# EAGLE design AJH_2b_v1_03 (EAGLE 9.6.2)

## Sheet 1 of 3
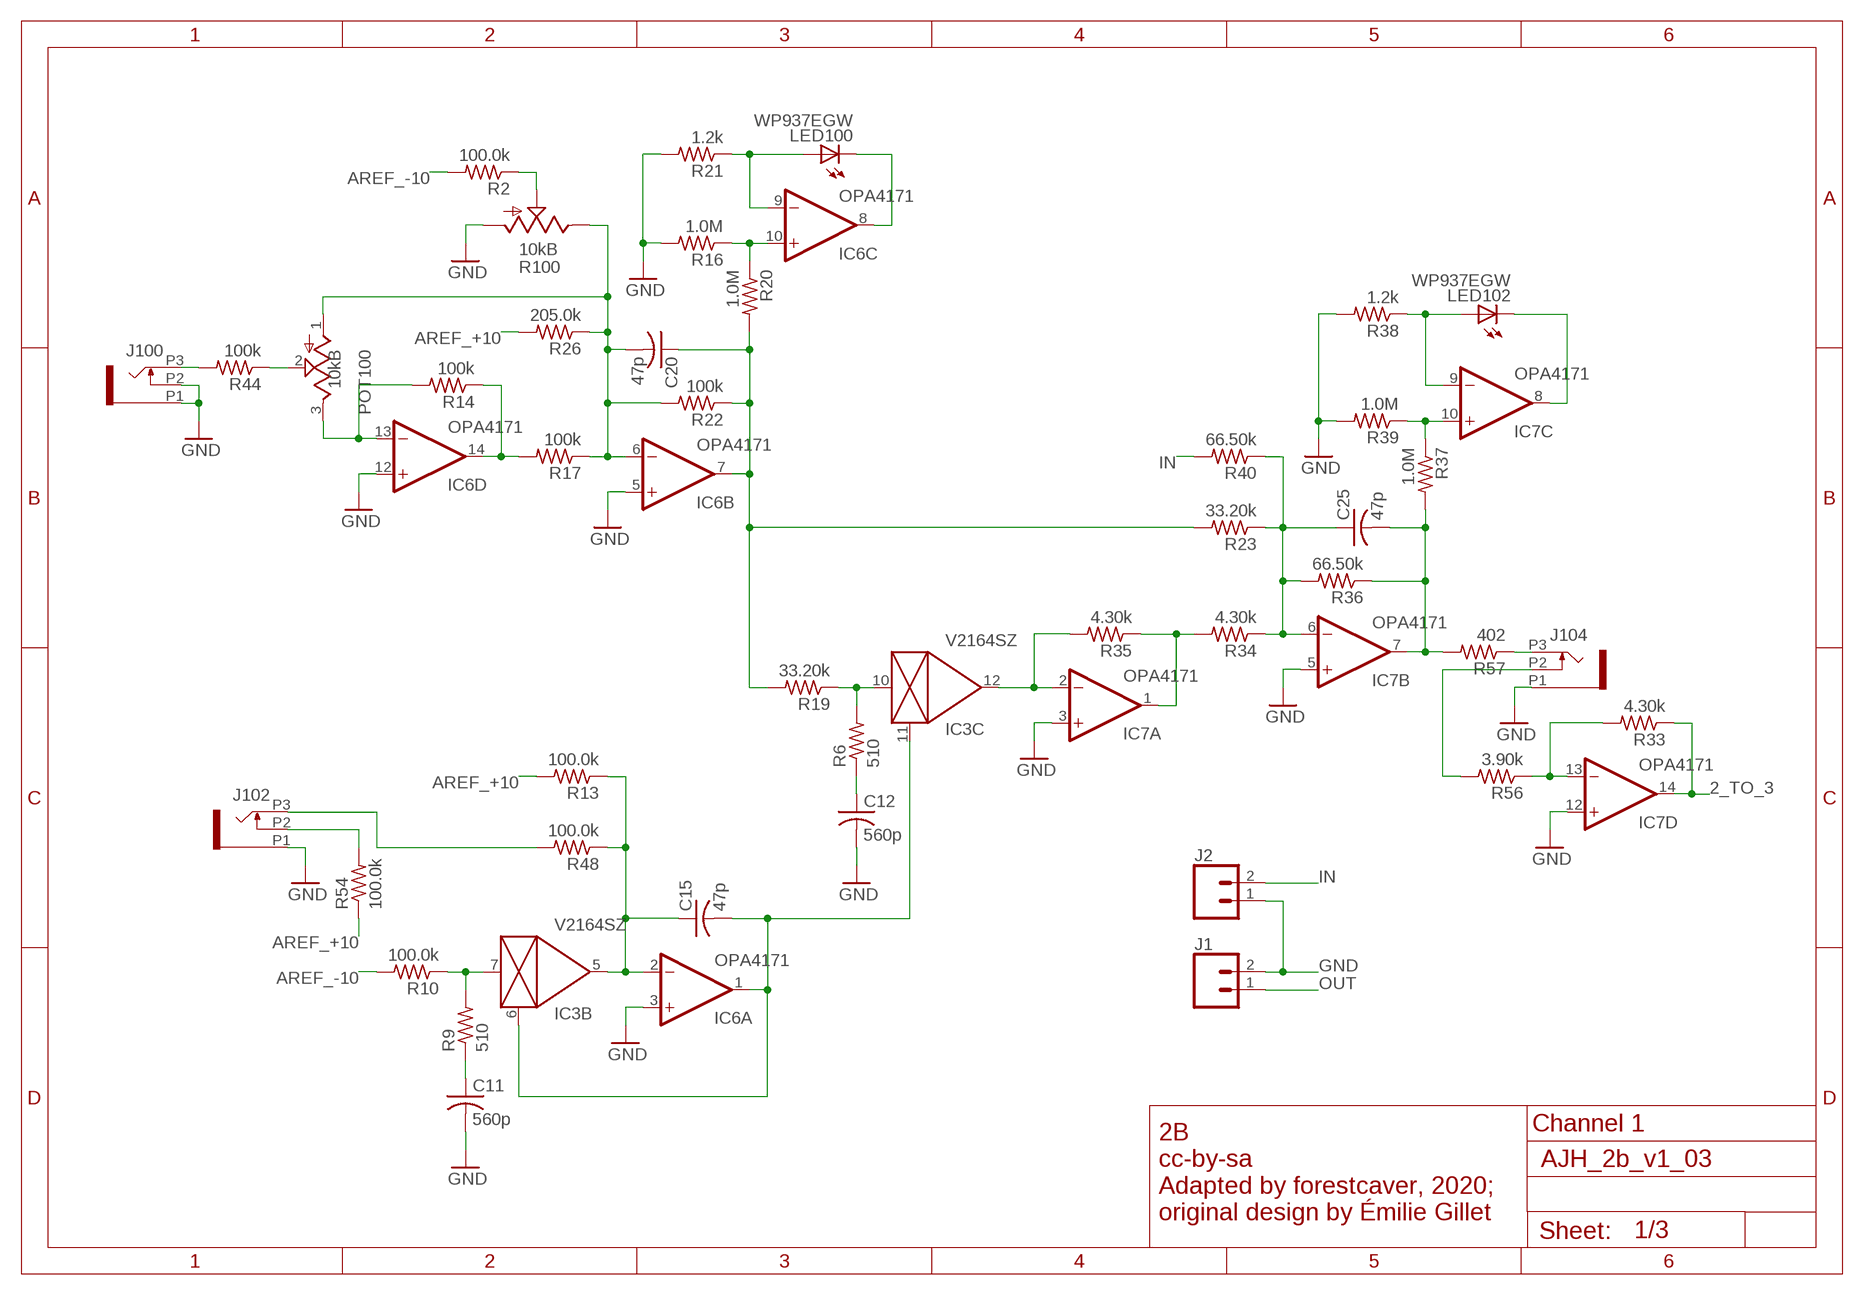
[diagram p0: schematic, sheet 1]

### Parts
C11  560p  C-USC0402  [C0402]
C12  560p  C-USC0402  [C0402]
C15  47p  C-USC0402  [C0402]
C20  47p  C-USC0402  [C0402]
C25  47p  C-USC0402  [C0402]
IC3  V2164SZ  SSM2164S  [SOIC16N]
IC6  OPA4171  TL074PW  [TSSOP14]
IC7  OPA4171  TL074PW  [TSSOP14]
J1  CONN_02  [1X02]
J2  CONN_02  [1X02]
J100  PJ301_THONKICONN6  [WQP_PJ_301M6]
J102  PJ301_THONKICONN6  [WQP_PJ_301M6]
J104  PJ301_THONKICONN6  [WQP_PJ_301M6]
LED100  WP937EGW  LED3MM  [LED3MM]
LED102  WP937EGW  LED3MM  [LED3MM]
POT100  10kB  POT_VERTICALNOHOLE  [ALPS_POT_NOHOLE]
R2  100.0k  R-US_R0402  [R0402]
R6  510  R-US_R0402  [R0402]
R9  510  R-US_R0402  [R0402]
R10  100.0k  R-US_R0402  [R0402]
R13  100.0k  R-US_R0402  [R0402]
R14  100k  R-US_R0402  [R0402]
R16  1.0M  R-US_R0402  [R0402]
R17  100k  R-US_R0402  [R0402]
R19  33.20k  R-US_R0402  [R0402]
R20  1.0M  R-US_R0402  [R0402]
R21  1.2k  R-US_R0402  [R0402]
R22  100k  R-US_R0402  [R0402]
R23  33.20k  R-US_R0402  [R0402]
R26  205.0k  R-US_R0402  [R0402]
R33  4.30k  R-US_R0402  [R0402]
R34  4.30k  R-US_R0402  [R0402]
R35  4.30k  R-US_R0402  [R0402]
R36  66.50k  R-US_R0402  [R0402]
R37  1.0M  R-US_R0402  [R0402]
R38  1.2k  R-US_R0402  [R0402]
R39  1.0M  R-US_R0402  [R0402]
R40  66.50k  R-US_R0402  [R0402]
R44  100k  R-US_R0402  [R0402]
R48  100.0k  R-US_R0402  [R0402]
R54  100.0k  R-US_R0402  [R0402]
R56  3.90k  R-US_R0402  [R0402]
R57  402  R-US_R0402  [R0402]
R100  10kB  POT_USVERTICAL_PS  [ALPS_POT_VERTICAL_PS]

### Nets
2_TO_3: IC7.14(D:OUT) R33.1 ; also sheet 2
AREF_+10: R13.2 R26.2 R54.1 ; also sheet 2,3
AREF_-10: R2.2 R10.2 ; also sheet 2,3
FOO1: IC3.7(B:IN) R9.2 R10.1
GAIN_2: C20.1 IC6.7(B:OUT) R19.2 R20.2 R22.1 R23.2
GND: C11.2 C12.2 IC6.3(A:+IN) IC6.5(B:+IN) IC6.12(D:+IN) IC7.3(A:+IN) IC7.5(B:+IN) IC7.12(D:+IN) J1.2 J2.1 J100.P1 J100.P2 J102.P1 J104.P1 R16.2 R21.2 R38.2 R39.2 R100.P$3(A) ; also sheet 2,3
IN: J2.2 R40.2
N$6: J104.P3 R57.1
N$17: C12.1 R6.1
N$24: IC3.10(C:IN) R6.2 R19.1
N$26: IC3.12(C:OUT) IC7.2(A:-IN) R35.2
N$27: C25.1 IC7.6(B:-IN) R23.1 R34.1 R36.2 R40.1
N$28: J100.P3 R44.2
N$29: IC6.13(D:-IN) POT100.3(B) R14.2
N$30: IC6.14(D:OUT) R14.1 R17.2
N$31: C20.2 IC6.6(B:-IN) POT100.1(A) R17.1 R22.2 R26.1 R100.P$1(E)
N$32: R2.1 R100.P$2(S)
N$33: IC6.8(C:OUT) LED100.K(C)
N$34: IC6.9(C:-IN) LED100.A R21.1
N$35: IC7.8(C:OUT) LED102.K(C)
N$36: IC7.9(C:-IN) LED102.A R38.1
N$37: IC7.13(D:-IN) R33.2 R56.1
N$38: J104.P2 R56.2
N$39: IC7.1(A:OUT) R34.2 R35.1
N$40: POT100.2(W) R44.1
N$41: C11.1 R9.1
N$42: C15.1 IC3.5(B:OUT) IC6.2(A:-IN) R13.1 R48.1
N$43: C15.2 IC3.6(B:CTRL) IC3.11(C:CTRL) IC6.1(A:OUT)
N$44: J102.P3 R48.2
N$87: J102.P2 R54.2
N$97: IC7.10(C:+IN) R37.1 R39.1
N$103: IC6.10(C:+IN) R16.1 R20.1
OUT: J1.1 ; also sheet 2
OUT2: C25.2 IC7.7(B:OUT) R36.1 R37.2 R57.2

### Notes on the sheet
- Channel 1
- 2B
  cc-by-sa
  Adapted by forestcaver, 2020;
  original design by Émilie Gillet

## Sheet 2 of 3
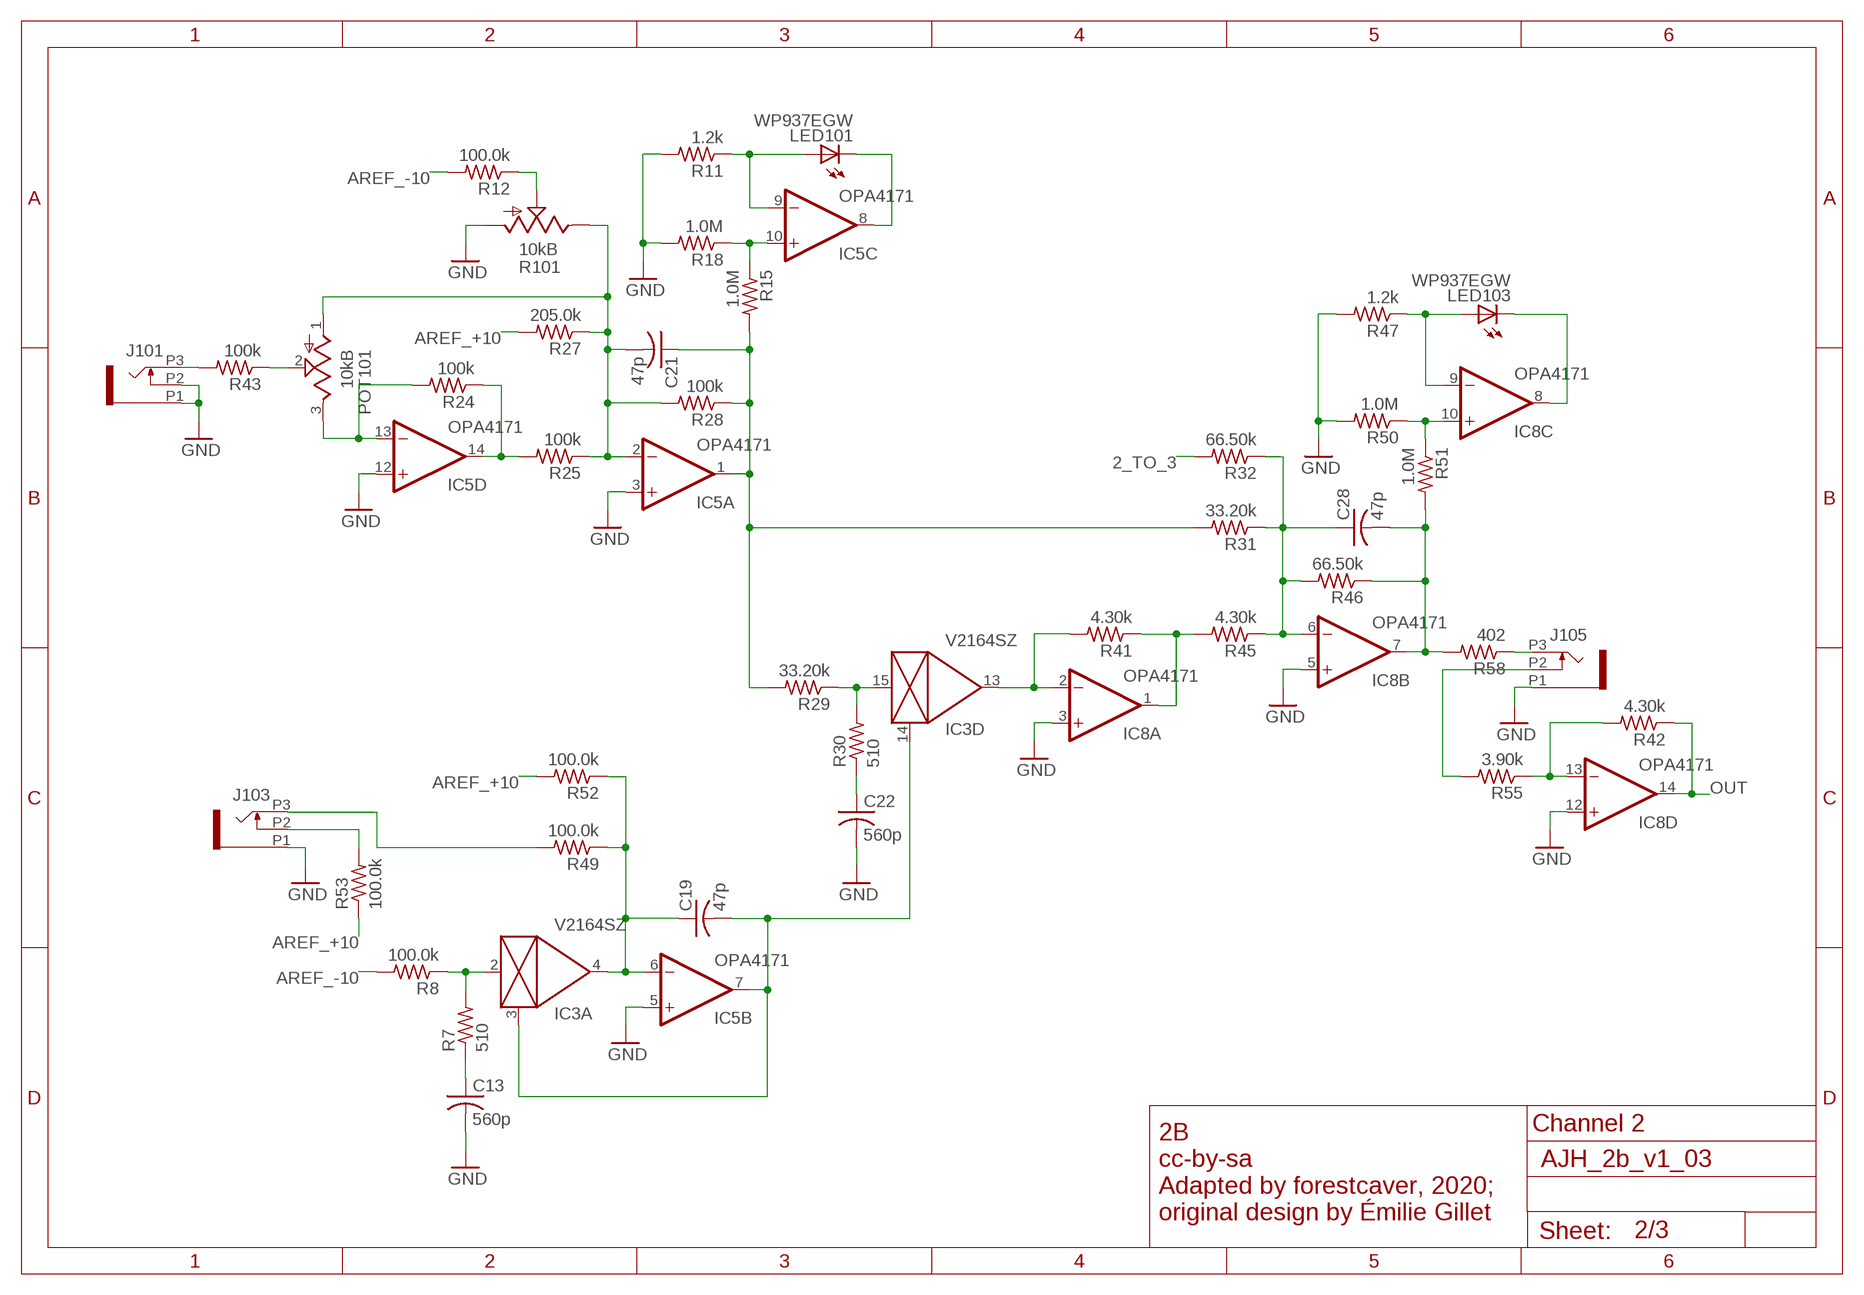
[diagram p1: schematic, sheet 2]

### Parts
C13  560p  C-USC0402  [C0402]
C19  47p  C-USC0402  [C0402]
C21  47p  C-USC0402  [C0402]
C22  560p  C-USC0402  [C0402]
C28  47p  C-USC0402  [C0402]
IC5  OPA4171  TL074PW  [TSSOP14]
IC8  OPA4171  TL074PW  [TSSOP14]
J101  PJ301_THONKICONN6  [WQP_PJ_301M6]
J103  PJ301_THONKICONN6  [WQP_PJ_301M6]
J105  PJ301_THONKICONN6  [WQP_PJ_301M6]
LED101  WP937EGW  LED3MM  [LED3MM]
LED103  WP937EGW  LED3MM  [LED3MM]
POT101  10kB  POT_VERTICALNOHOLE  [ALPS_POT_NOHOLE]
R7  510  R-US_R0402  [R0402]
R8  100.0k  R-US_R0402  [R0402]
R11  1.2k  R-US_R0402  [R0402]
R12  100.0k  R-US_R0402  [R0402]
R15  1.0M  R-US_R0402  [R0402]
R18  1.0M  R-US_R0402  [R0402]
R24  100k  R-US_R0402  [R0402]
R25  100k  R-US_R0402  [R0402]
R27  205.0k  R-US_R0402  [R0402]
R28  100k  R-US_R0402  [R0402]
R29  33.20k  R-US_R0402  [R0402]
R30  510  R-US_R0402  [R0402]
R31  33.20k  R-US_R0402  [R0402]
R32  66.50k  R-US_R0402  [R0402]
R41  4.30k  R-US_R0402  [R0402]
R42  4.30k  R-US_R0402  [R0402]
R43  100k  R-US_R0402  [R0402]
R45  4.30k  R-US_R0402  [R0402]
R46  66.50k  R-US_R0402  [R0402]
R47  1.2k  R-US_R0402  [R0402]
R49  100.0k  R-US_R0402  [R0402]
R50  1.0M  R-US_R0402  [R0402]
R51  1.0M  R-US_R0402  [R0402]
R52  100.0k  R-US_R0402  [R0402]
R53  100.0k  R-US_R0402  [R0402]
R55  3.90k  R-US_R0402  [R0402]
R58  402  R-US_R0402  [R0402]
R101  10kB  POT_USVERTICAL_PS  [ALPS_POT_VERTICAL_PS]

### Nets
2_TO_3: R32.2 ; also sheet 1
AREF_+10: R27.2 R52.2 R53.1 ; also sheet 1,3
AREF_-10: R8.2 R12.2 ; also sheet 1,3
FOO2: IC3.2(A:IN) R7.2 R8.1
GAIN_3: C21.1 IC5.1(A:OUT) R15.2 R28.1 R29.2 R31.2
GND: C13.2 C22.2 IC5.3(A:+IN) IC5.5(B:+IN) IC5.12(D:+IN) IC8.3(A:+IN) IC8.5(B:+IN) IC8.12(D:+IN) J101.P1 J101.P2 J103.P1 J105.P1 R11.2 R18.2 R47.2 R50.2 R101.P$3(A) ; also sheet 1,3
N$23: J105.P3 R58.1
N$45: C22.1 R30.1
N$46: IC3.15(D:IN) R29.1 R30.2
N$48: IC3.13(D:OUT) IC8.2(A:-IN) R41.2
N$49: C28.1 IC8.6(B:-IN) R31.1 R32.1 R45.1 R46.2
N$50: J101.P3 R43.2
N$51: IC5.13(D:-IN) POT101.3(B) R24.2
N$52: IC5.14(D:OUT) R24.1 R25.2
N$53: C21.2 IC5.2(A:-IN) POT101.1(A) R25.1 R27.1 R28.2 R101.P$1(E)
N$55: R12.1 R101.P$2(S)
N$56: IC5.8(C:OUT) LED101.K(C)
N$57: IC5.9(C:-IN) LED101.A R11.1
N$58: IC8.8(C:OUT) LED103.K(C)
N$59: IC8.9(C:-IN) LED103.A R47.1
N$60: IC8.13(D:-IN) R42.2 R55.1
N$61: J105.P2 R55.2
N$62: IC8.1(A:OUT) R41.1 R45.2
N$63: C13.1 R7.1
N$67: C19.1 IC3.4(A:OUT) IC5.6(B:-IN) R49.1 R52.1
N$68: C19.2 IC3.3(A:CTRL) IC3.14(D:CTRL) IC5.7(B:OUT)
N$70: POT101.2(W) R43.1
N$93: J103.P3 R49.2
N$94: J103.P2 R53.2
N$98: IC8.10(C:+IN) R50.1 R51.1
N$102: IC5.10(C:+IN) R15.1 R18.1
OUT: IC8.14(D:OUT) R42.1 ; also sheet 1
OUT3: C28.2 IC8.7(B:OUT) R46.1 R51.2 R58.2

### Notes on the sheet
- Channel 2
- 2B
  cc-by-sa
  Adapted by forestcaver, 2020;
  original design by Émilie Gillet

## Sheet 3 of 3
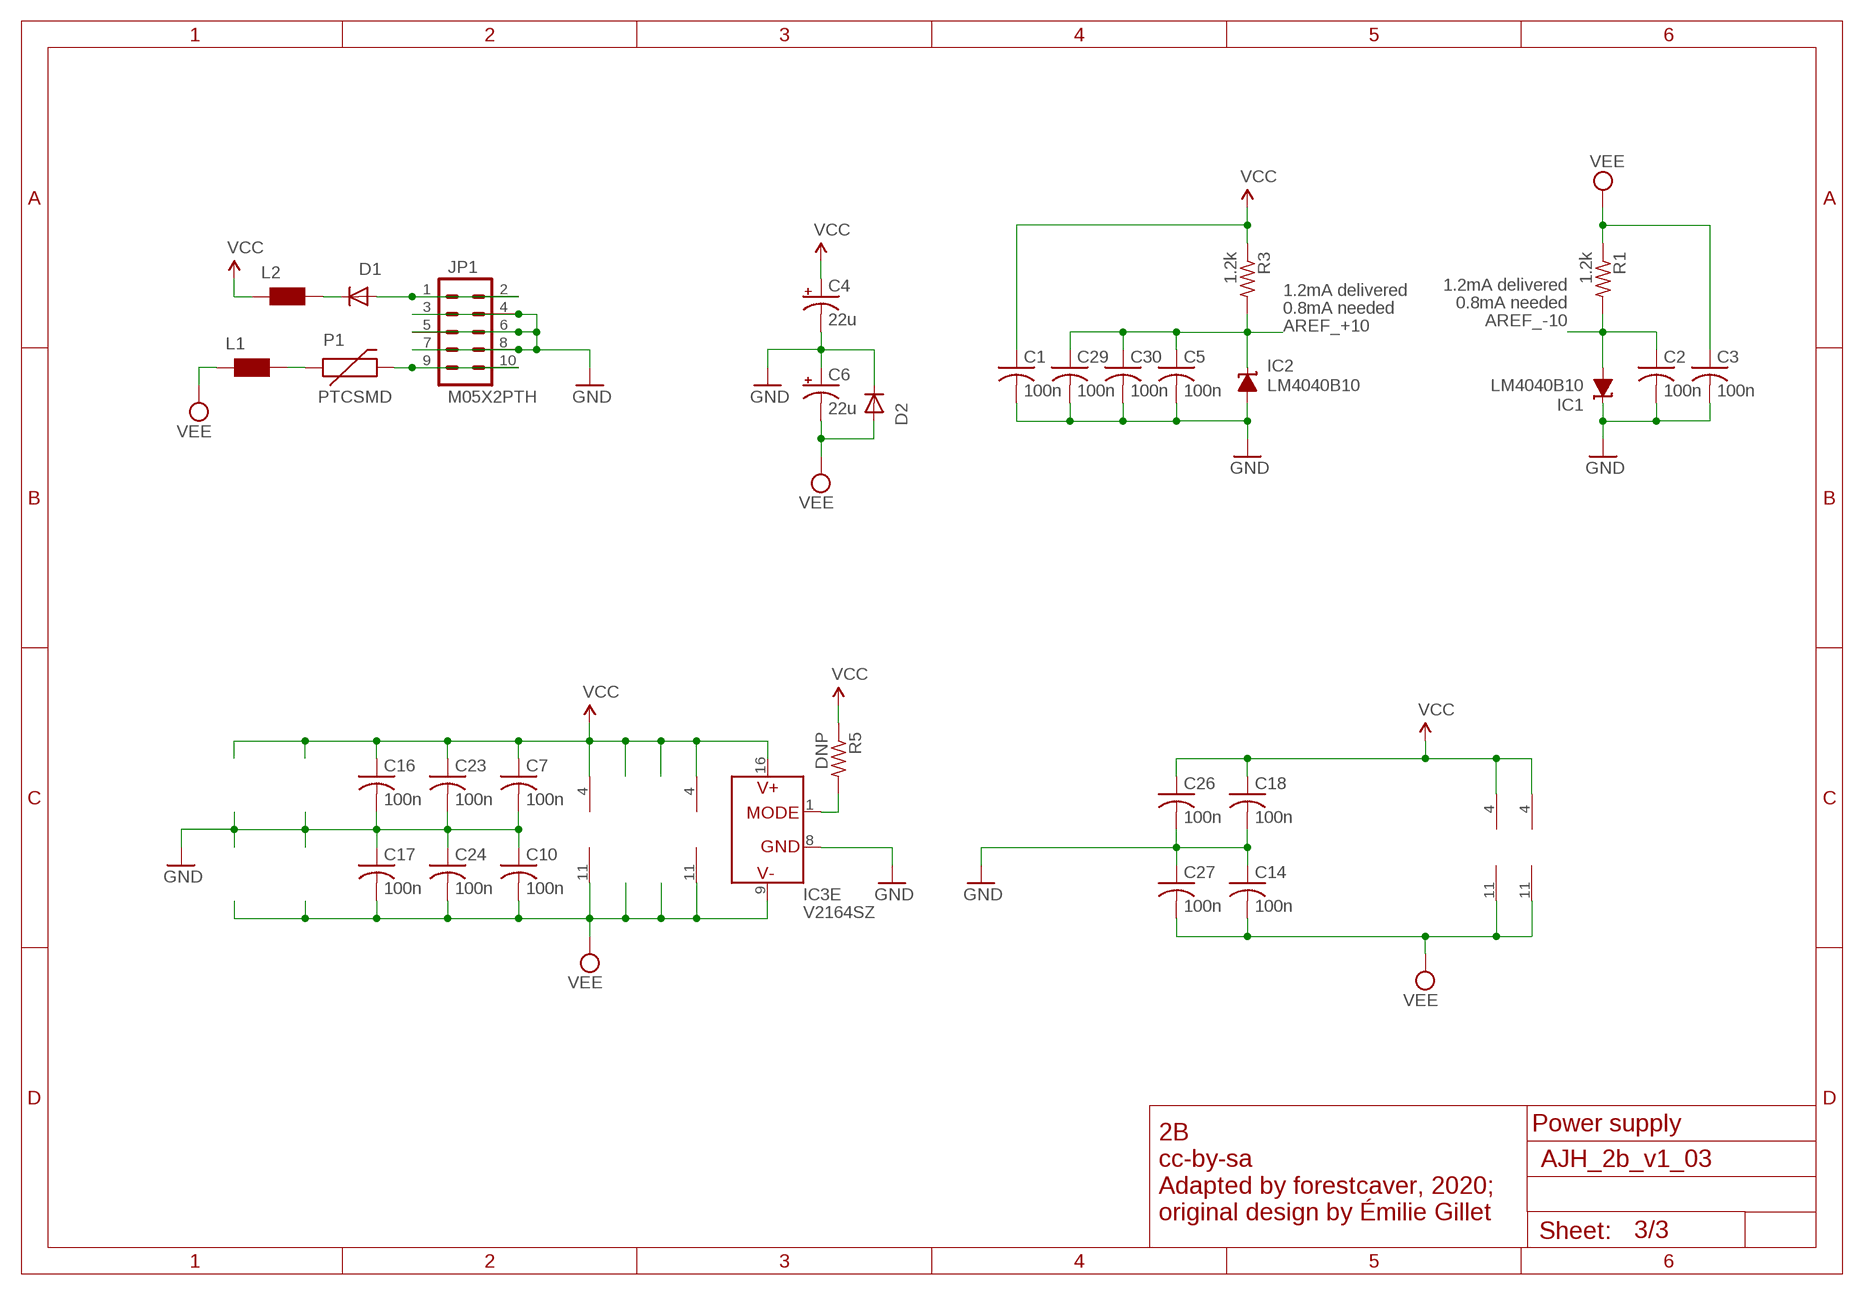
[diagram p2: schematic, sheet 3]

### Parts
C1  100n  C-USC0402  [C0402]
C2  100n  C-USC0402  [C0402]
C3  100n  C-USC0402  [C0402]
C4  22u  CPOL-USB  [PANASONIC_B]
C5  100n  C-USC0402  [C0402]
C6  22u  CPOL-USB  [PANASONIC_B]
C7  100n  C-USC0402  [C0402]
C10  100n  C-USC0402  [C0402]
C14  100n  C-USC0402  [C0402]
C16  100n  C-USC0402  [C0402]
C17  100n  C-USC0402  [C0402]
C18  100n  C-USC0402  [C0402]
C23  100n  C-USC0402  [C0402]
C24  100n  C-USC0402  [C0402]
C26  100n  C-USC0402  [C0402]
C27  100n  C-USC0402  [C0402]
C29  100n  C-USC0402  [C0402]
C30  100n  C-USC0402  [C0402]
D1  1N5819HW  DIODE-SOD123  [SOD123]
D2  1N5819HW  DIODE-SOD123  [SOD123]
IC1  LM4040B10  LM4041B12DBZ  [DBZ_R-PDSO-G3]
IC2  LM4040B10  LM4041B12DBZ  [DBZ_R-PDSO-G3]
JP1  M05X2PTH  [AVR_ICSP]
L1  WE-CBF_0603  [0603]
L2  WE-CBF_0603  [0603]
P1  PTCSMD  [PTC-1206]
R1  1.2k  R-US_R0402  [R0402]
R3  1.2k  R-US_R0402  [R0402]
R5  DNP  R-US_R0402  [R0402]

### Nets
AREF_+10: C5.1 C29.1 C30.1 IC2.1(C) R3.2 ; also sheet 1,2
AREF_-10: C2.1 IC1.2(A) R1.2 ; also sheet 1,2
GND: C1.2 C2.2 C3.2 C4.- C5.2 C6.+ C7.2 C10.1 C14.1 C16.2 C17.1 C18.2 C23.2 C24.1 C26.2 C27.1 C29.2 C30.2 D2.C IC1.1(C) IC2.2(A) IC3.8(E:GND) JP1.3 JP1.4 JP1.5 JP1.6 JP1.7 JP1.8 ; also sheet 1,2
N$1: IC3.1(E:MODE) R5.2
N$11: D1.A JP1.1 JP1.2
N$12: JP1.9 JP1.10 P1.2
N$13: L1.2 P1.1
N$16: D1.C L2.2
VCC: C1.1 C4.+ C7.1 C16.1 C18.1 C23.1 C26.1 IC3.16(E:V+) IC5.4(P:V+) IC6.4(P:V+) IC7.4(P:V+) IC8.4(P:V+) L2.1 R3.1 R5.1
VEE: C3.1 C6.- C10.2 C14.2 C17.2 C24.2 C27.2 D2.A IC3.9(E:V-) IC5.11(P:V-) IC6.11(P:V-) IC7.11(P:V-) IC8.11(P:V-) L1.1 R1.1

### Notes on the sheet
- 1.2mA delivered
- 1.2mA delivered | 0.8mA needed
- 0.8mA needed
- Power supply
- 2B
  cc-by-sa
  Adapted by forestcaver, 2020;
  original design by Émilie Gillet

## Library data of the parts
C1-C3 C5 C7 C10-C30 = rcl:C-US: CAPACITOR, American symbol; SPICEPREFIX: C
C4 C6 = rcl:CPOL-US: POLARIZED CAPACITOR, American symbol
D1 D2 = diode:DIODE-: DIODE
IC1 IC2 = texas:LM4041: PRECISION MICROPOWER SHUNT VOLTAGE REFERENCE Source: http://focus.ti.com/lit/ds/slcs146e/slcs146e.pdf
IC3 = ssm2164:SSM2164
IC5-IC8 = linear:TL074: OP AMP
J1 J2 = SparkFun-Connectors:CONN_02: Multi connection point. Often used as Generic Header-pin footprint for 0.1 inch spaced/style header connections On any of the 0.1 inch spaced packages, you can populate with these: Break Away Headers - Straight <https://www.sparkfun.com/products/116> (PRT-00116) Break Away Male Headers - Right Angle <https://www.sparkfun.com/products/553> (PRT-00553) Female Headers <https://www.sparkfun.com/products/115> (PRT-00115) Break Away Headers - Machine Pin <https://www.sparkfun.com/products/117> (PRT-00117) Break Away Female Headers - Swiss Machine Pin <https://www.sparkfun.com/products/743> (PRT-00743) For SCREWTERMINALS and SPRING TERMINALS visit here: Screw Terimnals on SparkFun.com <https://www.sparkfun.com/search/results?term=Screw+Terminals> (5mm/3.5mm/2.54mm spacing) This device is also useful as a general connection point to wire up your design to another part of your project. Our various solder wires solder well into these plated through hole pads. Hook-Up Wire - Assortment (Stranded, 22 AWG) <https://www.sparkfun.com/products/11375> (PRT-11375) Hook-Up Wire - Assortment (Solid Core, 22 AWG) <https://www.sparkfun.com/products/11367> (PRT-11367) View the entire wire category on our website here <https://www.sparkfun.com/categories/141> Special notes: Molex polarized connector foot print use with: PRT-08233 with associated crimp pins and housings. 2.54_SCREWTERM for use with PRT-10571. 3.5mm Screw Terminal footprints for PRT-08084 5mm Screw Terminal footprints for use with PRT-08432
J100-J105 = og-pj301:PJ301_THONKICONN
JP1 = og-header:M05X2: Header 5x2 Standard 10-pin dual row 0.1" header. Commonly used with AVR-ISP. Use with Spark Fun Electronics SKU: PRT-00778
L1 L2 = wuerth-elektronik:WE-CBF: SMD EMI Suppression Ferrite Beads - excellent anti-EMI properties - low DCR - impedances till 3000 ohms - rated current up to 6 A
LED100-LED103 = led:LED: LED OSRAM: - CHIPLED LG R971, LG N971, LY N971, LG Q971, LY Q971, LO R971, LY R971 LH N974, LH R974 LS Q976, LO Q976, LY Q976 LO Q996 - Hyper CHIPLED LW Q18S LB Q993, LB Q99A, LB R99A - SideLED LS A670, LO A670, LY A670, LG A670, LP A670 LB A673, LV A673, LT A673, LW A673 LH A674 LY A675 LS A676, LA A676, LO A676, LY A676, LW A676 LS A679, LY A679, LG A679 - Hyper Micro SIDELED® LS Y876, LA Y876, LO Y876, LY Y876 LT Y87S - SmartLED LW L88C, LW L88S LB L89C, LB L89S, LG L890 LS L89K, LO L89K, LY L89K LS L896, LA L896, LO L896, LY L896 - TOPLED LS T670, LO T670, LY T670, LG T670, LP T670 LSG T670, LSP T670, LSY T670, LOP T670, LYG T670 LG T671, LOG T671, LSG T671 LB T673, LV T673, LT T673, LW T673 LH T674 LS T676, LA T676, LO T676, LY T676, LB T676, LH T676, LSB T676, LW T676 LB T67C, LV T67C, LT T67C, LS T67K, LO T67K, LY T67K, LW E67C LS E67B, LA E67B, LO E67B, LY E67B, LB E67C, LV E67C, LT E67C LW T67C LS T679, LY T679, LG T679 LS T770, LO T770, LY T770, LG T770, LP T770 LB T773, LV T773, LT T773, LW T773 LH T774 LS E675, LA E675, LY E675, LS T675 LS T776, LA T776, LO T776, LY T776, LB T776 LHGB T686 LT T68C, LB T68C - Hyper Mini TOPLED® LB M676 - Mini TOPLED Santana® LG M470 LS M47K, LO M47K, LY M47K Source: http://www.osram.convergy.de LUXEON: - LUMILED® LXK2-PW12-R00, LXK2-PW12-S00, LXK2-PW14-U00, LXK2-PW14-V00 LXK2-PM12-R00, LXK2-PM12-S00, LXK2-PM14-U00 LXK2-PE12-Q00, LXK2-PE12-R00, LXK2-PE12-S00, LXK2-PE14-T00, LXK2-PE14-U00 LXK2-PB12-K00, LXK2-PB12-L00, LXK2-PB12-M00, LXK2-PB14-N00, LXK2-PB14-P00, LXK2-PB14-Q00 LXK2-PR12-L00, LXK2-PR12-M00, LXK2-PR14-Q00, LXK2-PR14-R00 LXK2-PD12-Q00, LXK2-PD12-R00, LXK2-PD12-S00 LXK2-PH12-R00, LXK2-PH12-S00 LXK2-PL12-P00, LXK2-PL12-Q00, LXK2-PL12-R00 Source: www.luxeon.com KINGBRIGHT: KA-3528ASYC Source: www.kingbright.com
P1 = SparkFun:PTC: Resettable Fuse PTC Resettable Fuse. Spark Fun Electronics SKU : COM-08357
POT100 POT101 = parts_aman:POT_VERTICAL
R1-R3 R5-R58 = resistor:R-US_: RESISTOR, American symbol
R100 R101 = pot-alps:POT_US

## Board
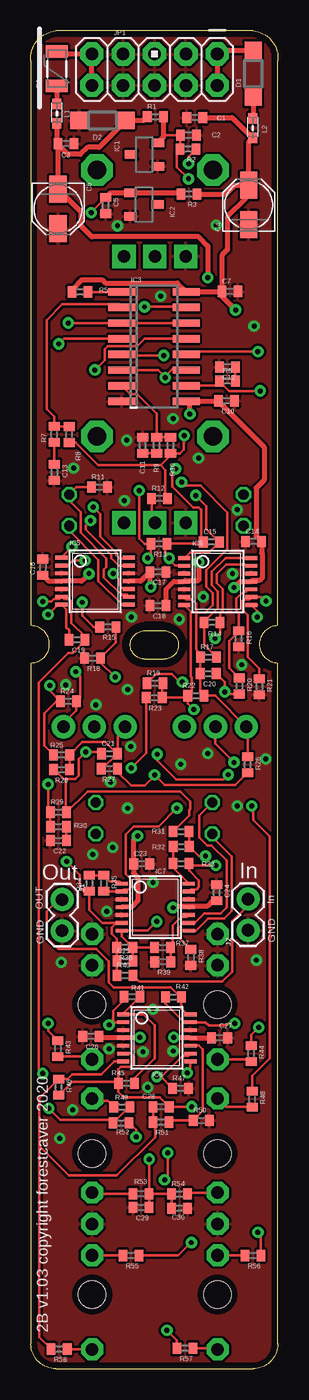
[diagram p3: board, top side]
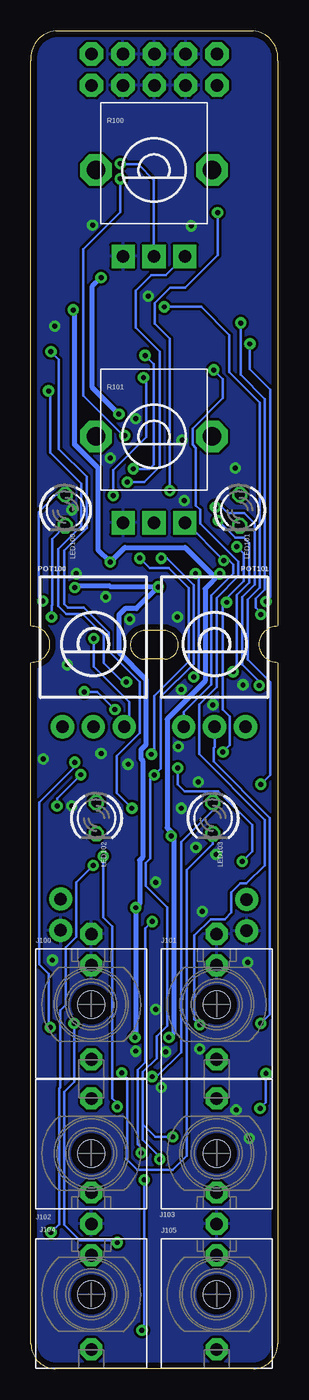
[diagram p4: board, bottom side, seen from below]

Size 20.02 x 108.41 mm. Coordinates in mm from the lower left corner, seen from the top.
Outline: 19.55,57.33 arc-45 19.55,57.33
Outline: 2.01,0 18.01,0 arc90 20.01,2 20.01,57.2 arc-180 20.01,60.2 20.01,106 arc90 18.01,108.41 2.01,108.41 arc90 0.01,106 0.01,60.2 arc-180 0.01,57.2 0.01,2 arc90 2.01,0
Outline: 9.21,57.5 arc-180 9.21,59.8 10.81,59.8 arc-180 10.81,57.5 9.21,57.5
Copper layers (1*16): Top 0.035mm / dielectric 1.5mm / Bottom 0.035mm
Design rules "foo": minimum track width 8mil, minimum drill 0.4mm, track to track 8mil, track to pad 8mil, pad to pad 8mil, via to via 8mil, smd to smd 8mil, copper to edge 20mil, drill to drill 8mil, minimum pad ring 8mil, minimum via ring 10mil, stop-mask expansion 3mil, vias tented up to drill 25mil, thermal gap 8mil
tRestrict: area 9.2,56.9 to 10.8,60.5; area -2.2,56.5 to 2.2,60.9; area 7.4,56.8 to 11,60.5; area 9,56.8 to 12.6,60.5; area 17.8,56.5 to 22.2,60.9; area 9.2,56.8 to 10.8,60.4

### Footprints (pad centres in the part's own frame; a part is rotated, then mirrored left to right if it is on the bottom)
C0402 = smd 0.7 x 0.9: 1 -0.65,0; 2 0.65,0
PANASONIC_B = smd 2.2 x 1.4: + 1.6,0; - -1.6,0
SOD123 = smd 1.4 x 1.4: A 1.9,0; C -1.9,0
DBZ_R-PDSO-G3 = smd 0.7 x 1: 1 -0.95,-1.1; 2 0.95,-1.1; 3 0,1.1
SOIC16N = smd 0.6 x 2.2: 1 -4.445,-2.6; 2 -3.175,-2.6; 3 -1.905,-2.6; 4 -0.635,-2.6; 5 0.635,-2.6; 6 1.905,-2.6; 7 3.175,-2.6; 8 4.445,-2.6; 9 4.445,2.6; 10 3.175,2.6; 11 1.905,2.6; 12 0.635,2.6; 13 -0.635,2.6; 14 -1.905,2.6; 15 -3.175,2.6; 16 -4.445,2.6
TSSOP14 = smd 0.305 x 0.991: 1 -1.905,-2.718; 2 -1.27,-2.718; 3 -0.635,-2.718; 4 0,-2.718; 5 0.635,-2.718; 6 1.27,-2.718; 7 1.905,-2.718; 8 1.905,2.718; 9 1.27,2.718; 10 0.635,2.718; 11 0,2.718; 12 -0.635,2.718; 13 -1.27,2.718; 14 -1.905,2.718
1X02 = drill 1.016 pad 1.88: 1 0,0; 2 2.54,0
WQP_PJ_301M6 = drill 1.016 pad 1.778 octagon: P1 0,-5.715; P2 0,-3.175; P3 0,4.445 | hole 2.2: 0,0
AVR_ICSP = drill 1.016 pad 1.88 octagon: 1 -1.27,5.08; 2 1.27,5.08; 3 -1.27,2.54; 4 1.27,2.54; 5 -1.27,0; 6 1.27,0; 7 -1.27,-2.54; 8 1.27,-2.54; 9 -1.27,-5.08; 10 1.27,-5.08
0603 = smd 0.85 x 0.7: 1 -0.9,0; 2 0.7,0
LED3MM = drill 0.813 octagon: A -1.27,0; K 1.27,0
PTC-1206 = smd 1 x 1.8: 1 -1.4,0; 2 1.4,0
ALPS_POT_NOHOLE = drill 1 pad 1.88: 1 -2.5,-6.7; 2 0,-6.7; 3 2.5,-6.7
R0402 = smd 0.7 x 0.9: 1 -0.65,0; 2 0.65,0
ALPS_POT_VERTICAL_PS = drill 1 pad 1.88 square: P$1 -2.5,7; P$2 0,7; P$3 2.5,7 | drill 1.5 pad 2.54 octagon: P$4 -4.7,0; P$5 4.7,0

### Placement (x,y rotation side)
C1  13.28,101.38 180 top
C2  12.78,99.95 0 top
C3  2.85,99.27 0 top
C4  17.65,94.29 90 top
C5  6.06,94.25 270 top
C6  2.21,93.98 270 top
C7  16.12,87.29 0 top
C10  15.86,78.43 180 top
C11  9.06,74.83 90 top
C12  15.92,81.17 180 top
C13  1.91,72.63 270 top
C14  18.05,67.03 0 top
C15  14.62,66.99 0 top
C16  0.97,64.95 90 top
C17  10.3,64.57 180 top
C18  10.3,61.83 180 top
C19  3.75,59.07 180 top
C20  14.37,56.33 180 top
C21  6.37,49.83 0 top
C22  2.23,42.79 180 top
C23  8.98,40.9 0 top
C24  15.05,38.58 270 top
C25  7.62,33.03 0 top
C26  4.86,26.93 180 top
C27  15.3,26.82 180 top
C28  10.56,21.22 180 top
C29  8.93,13.07 180 top
C30  12.05,13 0 top
D1  18.01,104.94 90 top
D2  5.8,101.15 0 top
IC1  9.19,98.38 90 top
IC2  9.16,94.33 270 top
IC3  9.98,82.82 270 top
IC5  5.21,63.82 270 top
IC6  15.14,63.79 270 top
IC7  10.08,37.4 270 top
IC8  10.21,26.8 270 top
J1  2.54,38.02 270 top
J2  17.6,35.52 90 top
J100  15.13,29.51 180 bottom
J101  4.97,29.51 180 bottom
J102  15.13,17.44 0 bottom
J103  4.97,17.44 0 bottom
J104  15.13,6.01 180 bottom
J105  4.97,6.01 180 bottom
JP1  10.02,105.26 270 top
L1  2.1,101.8 90 top
L2  17.98,100.61 90 top
LED100  17.23,69.57 270 bottom
LED101  3.1,69.57 270 bottom
LED102  14.71,44.6 270 bottom
LED103  5.27,44.6 270 bottom
P1  2.11,105.33 90 top
POT100  14.95,58.72 0 bottom
POT101  5.14,58.72 0 bottom
R1  10.08,101.44 0 top
R2  12.73,98.83 180 top
R3  12.81,95.18 180 top
R5  3.98,87.25 0 top
R6  15.92,80.03 180 top
R7  1.88,75.7 90 top
R8  3.11,75.69 270 top
R9  10.18,74.83 90 top
R10  11.31,74.82 270 top
R11  5.56,71.43 0 top
R12  10.43,70.52 0 top
R13  10.37,66.84 180 top
R14  14.68,60.47 0 top
R15  6.23,60.1 180 top
R16  16.83,59.14 270 top
R17  14.39,57.66 0 top
R18  4.98,57.58 180 top
R19  10.05,55.54 0 top
R20  16.88,55.32 270 top
R21  18.51,55.27 270 top
R22  13.36,54.53 0 top
R23  10,54.38 0 top
R24  3.05,54.08 0 top
R25  2.5,49.74 180 top
R26  17.56,48.94 270 top
R27  6.36,48.62 0 top
R28  2.48,48.54 0 top
R29  2.25,45.09 0 top
R30  2.23,43.92 180 top
R31  12.17,43.52 180 top
R32  12.18,42.3 180 top
R33  12.17,40.93 0 top
R34  4.73,39.33 90 top
R35  5.91,39.33 270 top
R36  7.61,34.14 180 top
R37  10.67,34.13 180 top
R38  12.96,33.33 270 top
R39  10.68,32.97 180 top
R40  7.62,31.87 0 top
R41  8.18,30.14 180 top
R42  11.55,30.12 180 top
R43  2.18,25.94 270 top
R44  17.85,25.53 270 top
R45  7.75,23.13 0 top
R46  2.25,22.82 270 top
R47  12.12,22.72 0 top
R48  17.93,21.85 270 top
R49  7.37,21.2 180 top
R50  13.81,20.12 0 top
R51  10.55,19.98 180 top
R52  7.31,19.9 0 top
R53  8.93,14.18 180 top
R54  12.04,14.16 0 top
R55  8.11,9.17 180 top
R56  17.98,9.17 180 top
R57  12.48,1.65 180 top
R58  2.3,1.59 180 top
R100  10.05,97.13 180 bottom
R101  10.05,75.54 180 bottom

### Tracks (layer width: path | path; a pad name or v marks a point on that pad's centre or on a via)
2_TO_3
  Top 0.203: IC7.14 11.52,40.58 R33.1 11.52,42.29 R32.2
AREF_+10  (via drill 0.4)
  Top 0.203: C5.1 4.9,93.73 v4.9,93.67 | 9.58,14.1 R53.1 9.6,14.16 R54.1 11.4,14.14 C30.1 | 9.58,14.1 C29.1 | v8.77,71.17 8.77,69.63 8.79,69.61 8.79,67.27 9.22,66.84 R13.2 9.72,65.94 v9.46,65.67 | R26.2 16.56,47.29 10.83,47.29 v10.02,48.1 10.02,48.04 9.22,47.24 8.13,47.24 7.01,48.37 R27.2 | 7.97,19.89 R52.2 8.52,19.34 v8.52,18.79 | v9.58,16.98 9.58,14.11 9.58,14.1
  Top 0.406: IC2.1 8.18,95.4 | 12.01,95.33 R3.2 12.06,95.28 IC2.1 | IC2.1 6.43,95.27 C5.1
  Bottom 0.203: v9.46,65.67 9.02,65.67 6.83,63.49 6.83,57.11 9.49,54.46 9.49,48.63 v10.02,48.1 10.34,47.78 10.34,41.35 10.7,40.99 10.7,39.11 8.97,37.37 8.97,27.79 9.84,26.92 9.84,25.15 10.96,24.03 10.96,19.79 | 10.96,19.79 10.96,18.54 9.58,17.17 v9.58,16.98 | 10.96,19.79 9.96,18.79 v8.52,18.79 | v4.9,93.67 4.9,90.23 7.51,87.61 8.71,87.61 9.97,86.36 9.97,84.66 8.77,83.47 v8.77,71.17
AREF_-10  (via drill 0.4)
  Top 0.203: R8.2 3.62,75.04 5.45,73.21 10.51,73.21 | 10.51,73.21 11.39,74.09 R10.2 12.05,74.17 12.38,74.49 12.38,75.44 12.42,75.48 v12.42,75.6 | R12.2 10.9,70.7 10.9,72.82 10.51,73.21 | IC1.2 10.91,99.95 C2.1 12.08,99.91 R2.2 11.83,98.58 11.83,97.35 v12.77,96.42
  Top 0.406: R1.2 10.73,99.77 IC1.2
  Bottom 0.203: v12.77,96.42 12.77,93.73 15.77,90.73 15.77,78.83 12.54,75.6 v12.42,75.6
FOO1
  Top 0.203: R10.1 11.3,75.48 R9.2 10.18,77.4 8.6,78.98 8.04,78.98 IC3.7
FOO2
  Top 0.203: R8.1 1.9,76.34 R7.2 1.88,77.16 1.28,77.76 1.28,84.96 2.56,86.25 7.13,86.25 IC3.2
GAIN_2  (via drill 0.4)
  Top 0.203: IC6.7 12.97,61.34 12.97,56.08 13.05,56.01 13.05,54.87 R22.1 | 15.04,56.33 C20.1 15.7,55.65 v15.7,54.84 15.88,54.67 R20.2 16.88,54.86 | R19.2 10.65,55.49 R23.2 12.56,54.38 R22.1 | v13.21,53.42 12.71,53.92 R22.1
  Bottom 0.203: v15.7,54.84 14.63,54.84 v13.21,53.42
GAIN_3  (via drill 0.4)
  Top 0.203: IC5.1 2.49,65.76 v3.33,66.6 | R15.2 5.1,60.1 4.17,61.04 v4.17,62.1 | R28.1 1.9,48.54 2.66,47.79 2.83,47.79 | 2.83,47.79 3.62,47.79 3.9,48.07 3.9,49.42 v4.46,49.98 5.57,49.98 C21.1 5.66,49.83 | 2.83,47.79 2.83,45.15 R29.2 4.6,46.79 6.13,46.79 6.14,46.78 6.77,46.78 6.78,46.79 12.09,46.79 12.9,45.98 12.9,45.35 12.83,45.28 12.83,44.83 R31.2
  Bottom 0.203: v3.33,66.6 2.77,66.04 2.77,63.84 4.17,62.45 v4.17,62.1 4.46,61.81 4.46,53.41 3.89,52.84 3.89,50.54 v4.46,49.98
GND  (via drill 0.4)
  other vias: 18.08,84.48 12.02,60.73 13.96,62.54 3.46,72.98 10.52,86.92 16.33,64.42 17.08,57.04 6.15,37.04 6.33,25.92 8.15,60.92 7.77,75.23 14.33,49.85 7.58,70.35 13.58,73.79 11.52,76.98 16.71,45.6 12.15,48.98 16.71,69.6 9.08,25.67 11.52,25.73 2.46,32.92 5.02,41.67 9.46,22.79 9.9,29.1 9.9,39.42 15.02,92.67 7.83,55.04 2.83,55.42 8.08,50.42 7.83,45.42 6.46,47.54 19.02,49.42 18.27,33.1 6.65,42.23 7.02,92.6 5.27,53.79 3.4,20.98 2.33,18.67
  pour Top: -0.35,108.79 20.33,108.79 20.46,108.67 20.46,-0.46 -0.54,-0.46 -0.6,-0.4 -0.6,108.79
  pour Bottom: 0.08,-0.08 20.33,-0.08 20.46,0.04 20.46,108.98 20.4,109.04 -1.1,109.04 -1.1,-0.08
IN
  Top 0.203: J2.2 17.6,37.56 16.33,36.29 16.33,32.17 16.3,32.17 15.49,31.36 8.77,31.36 R40.2
N$1
  Top 0.203: R5.2 7.37,87.25 IC3.1
N$6
  Top 0.203: R57.1 15.04,1.65 J104.P3
N$11
  Top 0.406: JP1.2 JP1.1 15.41,106.84 D1.A
N$12
  Top 0.406: P1.2 2.31,106.53 JP1.9 JP1.10
N$13
  Top 0.406: P1.1 L1.2
N$16
  Top 0.406: D1.C 18.01,101.35 L2.2
N$17
  Top 0.203: C12.1 R6.1
N$23
  Top 0.203: J105.P3 2.97,1.57 R58.1
N$24  (via drill 0.4)
  Top 0.203: v12.28,55.64 12.07,55.64 11.42,56.3 10.15,56.3 R19.1 | IC3.10 14.89,79.65 R6.2 16.07,79.23 v18.58,79.23
  Bottom 0.203: v18.58,79.23 18.46,79.1 18.46,74.24 15.94,71.72 15.94,68.26 17.79,66.41 17.79,61.81 17.15,61.17 15.82,61.17 14.13,59.47 14.13,57.18 12.59,55.64 v12.28,55.64
N$26  (via drill 0.4)
  Top 0.203: R35.2 IC7.2 7.54,38.85 7.99,38.85 8.17,39.02 8.17,39.58 7.68,40.07 7.68,43.27 8.33,43.92 10.34,43.92 v11.83,45.42 | IC3.12 12.81,82.42 v18.4,82.42
  Bottom 0.203: v18.4,82.42 17.74,81.76 17.74,74.51 15.51,72.28 15.51,68.11 17.33,66.29 17.33,61.98 17.02,61.67 15.75,61.67 13.72,59.64 13.72,58.16 11.21,55.65 11.21,51.5 13.07,49.64 13.07,46.66 v11.83,45.42
N$27  (via drill 0.4)
  Top 0.203: 6.92,36.13 5.78,36.13 4.73,37.18 R34.1 4.3,38.68 3.98,39 3.98,40.02 v2.9,41.1 | 6.92,36.13 IC7.6 | 6.92,36.13 6.57,35.77 6.57,35.21 6.96,34.82 R36.2 C25.1 R40.1 | R23.1 9.35,49.89 v8.12,48.67
  Bottom 0.203: v8.12,48.67 8.12,47.35 7.55,46.78 6.14,46.78 6.13,46.79 4.83,46.79 2.08,44.04 2.08,41.92 v2.9,41.1
N$28
  Top 0.203: R44.2 17.66,25.07 J100.P3
N$29  (via drill 0.4)
  Top 0.203: R14.2 15.58,60.72 | R14.2 15.33,59.58 v14.92,59.16 | IC6.13 17.46,65.06 17.34,65.18 15.84,65.18 15.07,64.41 15.07,63.65 15.56,63.16 15.56,61.49 15.33,61.25 R14.2
  Bottom 0.203: POT100.3 12.04,52.43 12.04,54.04 14.92,56.91 v14.92,59.16
N$30
  Top 0.203: IC6.14 15.79,65.71 14.67,64.58 14.67,63.48 15.16,62.99 15.16,61.65 14.03,60.53 R14.1 14.03,58.66 R17.2
N$31  (via drill 0.4)
  Top 0.203: IC6.6 12.6,62.34 13.05,62.34 13.38,62.01 13.38,61.28 | 13.38,61.28 13.38,58.26 13.74,57.9 R17.1 13.74,56.35 C20.2 13.72,54.82 R22.2 14.94,54.53 POT100.1 17.56,51.91 R26.1 | v12.21,71.85 12.52,71.54 13.77,71.54 15.93,69.39 15.93,66.41 14.21,64.7 14.21,63.36 14.72,62.86 14.72,61.93 14.75,61.9 14.14,61.28 13.38,61.28
  Bottom 0.203: v12.21,71.85 10.83,71.85 9.58,73.1 9.58,82.42 11.52,84.35 11.52,87.35 10.27,88.6 9.08,88.6 R100.P$1
N$32  (via drill 0.4)
  Top 0.203: R2.1 12.78,98.22 v12.78,97.64
  Bottom 0.203: v12.78,97.64 12.75,97.61 11.33,97.61 10.05,96.33 R100.P$2
N$33  (via drill 0.4)
  Top 0.203: 18.29,61.88 17.87,61.88 IC6.8 18.35,61.4 v18.35,60.92
  Bottom 0.203: v18.35,60.92 18.35,61.82 18.29,61.88 18.29,67.24 LED100.K
N$34  (via drill 0.4)
  Top 0.203: R21.1 18.51,56.73 17.59,57.65 17.59,61.08 17.06,61.61 17.06,62.16 17.24,62.34 17.68,62.34 IC6.9 18.72,62.52 v19.05,62.2
  Bottom 0.203: v19.05,62.2 19.4,62.54 19.4,69.42 17.97,70.84 LED100.A
N$35
  Top 0.203: IC7.8 12.81,35.48 13.36,35.48 14.36,36.48 15.66,36.48 16.27,37.1 16.27,41.52 14.71,43.08 LED102.K
N$36
  Top 0.203: R38.1 11.96,34.98 11.96,35.73 12.36,36.13 IC7.9 13.27,36.12 14.04,36.89 15.36,36.89 15.86,37.39 15.86,41.17 14.61,42.42 14.29,42.42 13.65,43.06 13.65,44.81 LED102.A
N$37  (via drill 0.4)
  Top 0.203: IC7.13 12.98,38.85 13.42,38.85 13.6,39.02 13.6,39.58 12.82,40.36 R33.2 12.98,40.77 14.46,40.77 14.47,40.78 v14.97,40.78 | v18.4,11.04 18.63,10.8 R56.1
  Bottom 0.203: v14.97,40.78 16.36,39.39 16.36,35 17.21,34.15 17.21,29.49 17.65,29.05 17.65,22.8 17.74,22.71 17.74,11.7 v18.4,11.04
N$38
  Top 0.203: R56.2 15.15,9.17 J104.P2
N$39
  Top 0.203: IC7.1 7.18,39.49 6.4,39.49 R35.1 R34.2
N$40  (via drill 0.4)
  Top 0.203: v18.46,27.67 17.85,27.06 R44.1 | POT100.2 14.95,50.64 v16.46,49.14
  Bottom 0.203: v18.46,27.67 18.58,27.79 18.58,31.99 19.35,32.75 19.35,45.87 16.46,48.76 v16.46,49.14
N$41
  Top 0.203: R9.1 C11.1
N$42  (via drill 0.4)
  Top 0.203: v11.73,72.92 11.63,72.92 11.45,72.73 11.45,71.49 13.15,69.79 13.61,69.79 13.76,69.64 13.79,69.64 13.79,67.17 C15.1 13.86,66.88 11.06,66.88 R13.1 10.9,66.72 10.9,65.99 v11.21,65.67 11.21,65.53 11.68,65.06 IC6.2 | v10.77,82.1 7.46,82.1 IC3.5 | R48.1 17.93,23.73 19.35,25.14 19.35,43.15 18.02,44.47 18.02,45.47 v17.9,45.59 | v15.98,48.13 15.6,47.75 11.79,47.75 10.25,49.29 v10.25,49.79
  Bottom 0.203: v10.77,82.1 10.08,81.42 10.08,73.25 10.42,72.92 v11.73,72.92 | v11.21,65.67 10.4,64.86 8.83,64.86 7.24,63.27 7.24,57.28 10.02,54.5 10.02,50.02 v10.25,49.79 | v17.9,45.59 17.9,46.21 v15.98,48.13
N$43  (via drill 0.4)
  Top 0.203: IC6.1 12.48,65.7 12.9,66.12 14.4,66.12 C15.2 14.21,68.05 14.21,69.91 v13.35,70.77 | 12.73,80.83 12.66,80.83 IC3.11 12.52,80.98 11.46,80.98 10.9,80.42 10.9,80.35 | v10.9,80.3 10.9,80.35 | IC3.6 10.33,80.92 10.9,80.35
  Bottom 0.203: v10.9,80.3 10.65,80.06 10.65,75.5 13.35,72.81 v13.35,70.77
N$44
  Top 0.203: R48.2 15.81,21.2 J102.P3
N$45
  Top 0.203: C22.1 R30.1
N$46  (via drill 0.4)
  Top 0.203: R30.2 1.58,45.08 R29.1 1.4,45.29 v1.4,47.35 | v9.21,86.04 12.53,86.04 IC3.15
  Bottom 0.203: v1.4,47.35 0.65,48.1 0.65,55.65 2.45,57.46 2.45,62.34 1.48,63.31 1.48,78.29 3.94,80.75 3.94,83.76 6.22,86.04 v9.21,86.04
N$48  (via drill 0.4)
  Top 0.203: R41.2 7.53,29.83 6.69,28.99 6.69,28.21 v6.34,27.86 6.55,28.07 IC8.2 | v5.19,80.93 5.97,81.71 5.97,82.61 6.21,82.85 8.6,82.85 9.21,83.46 IC3.13
  Bottom 0.203: v6.34,27.86 6.78,28.31 6.78,35.09 5.46,36.42 4.33,36.42 3.78,36.97 3.78,38.57 3.05,39.3 2.57,39.3 1.08,40.79 1.08,44.48 6.39,49.79 6.39,53.83 4.98,55.24 4.98,62.47 3.23,64.22 3.23,65.4 6.3,68.47 6.3,69.61 6.65,69.95 6.65,74.62 6.92,74.89 6.92,76.2 4.46,78.66 4.46,80.2 v5.19,80.93
N$49  (via drill 0.4)
  Top 0.203: R46.2 3.33,23.25 6.97,23.25 R45.1 | R45.1 7.1,24.25 7.28,24.44 8.11,24.44 8.33,24.66 8.33,25.29 8.09,25.53 IC8.6 | R31.1 12.83,43.5 R32.1 13.6,41.53 v14.15,41.53 | R45.1 7.1,22.45 7.54,22 10.43,22 C28.1 13.01,21.22 v13.02,21.23
  Bottom 0.203: v14.15,41.53 14.15,36.55 13.42,35.82 13.42,21.92 13.02,21.52 v13.02,21.23
N$50
  Top 0.203: 2.37,25.1 R43.2 4.74,25.29 J101.P3
N$51  (via drill 0.4)
  Top 0.203: POT101.3 2.64,52.27 3.7,53.32 R24.2 4.01,54.39 4.01,56.11 v3.64,56.47 | IC5.13 7.92,65.08 7.12,65.08 6.52,65.67 6.52,65.91 4.44,68 4.44,68.33 v4.83,68.73
  Bottom 0.203: v3.64,56.47 3.39,56.72 3.39,56.97 3.33,57.03 3.33,62.71 2.32,63.71 2.32,66.92 2.77,67.36 3.46,67.36 v4.82,68.73 v4.83,68.73
N$52  (via drill 0.4)
  Top 0.203: v5.06,69.83 5.62,69.27 5.62,67.44 6.93,66.13 6.93,65.95 7.21,65.67 7.87,65.67 IC5.14 | v1.52,55.35 1.52,54.95 R24.1 2.06,54.08 1.08,53.09 1.08,50.51 R25.2
  Bottom 0.203: v1.52,55.35 1.52,55.67 2.9,57.04 2.9,62.52 1.89,63.53 1.89,68.47 2.75,69.33 4.06,69.33 4.56,69.83 v5.06,69.83
N$53  (via drill 0.4)
  Top 0.203: IC5.2 2.99,65.08 3.39,65.48 v4.39,65.48 | POT101.1 7.64,51.85 7.02,51.24 C21.2 6.98,49.83 | 6.98,49.83 5.77,48.62 R27.1 | R28.2 3.15,48.55 R25.1 4.18,50.77 6.04,50.77 6.98,49.83
  Bottom 0.203: R101.P$1 7.45,68.54 v4.39,65.48 3.95,65.48 3.64,65.17 3.64,64.41 5.39,62.66 5.39,55.45 7.64,53.2 POT101.1
N$55
  Top 0.203: R101.P$2 9.78,68.81 R12.1
N$56
  Top 0.203: IC5.8 7.92,61.9 7.4,61.9 5.48,63.82 5.48,65.53 3.1,67.91 LED101.K
N$57
  Top 0.203: IC5.9 7.75,62.73 7.3,62.73 5.92,64.11 5.92,64.76 6.12,64.95 6.12,65.66 4.03,67.74 4.03,69.41 3.1,70.34 LED101.A 3.1,70.87 3.66,71.43 R11.1
N$58  (via drill 0.4)
  Top 0.203: v12.66,23.98 12.93,24.25 IC8.8
  Bottom 0.203: v12.66,23.98 12.22,23.54 12.22,16.91 11.4,16.09 8.52,16.09 7.39,17.23 7.39,40.4 5.27,42.52 LED103.K
N$59  (via drill 0.4)
  Top 0.203: R47.1 10.52,23.67 v10.2,23.67 10.61,23.67 12.3,25.36 12.75,25.36 IC8.9
  Bottom 0.203: v10.2,23.67 9.82,23.67 7.86,25.63 7.86,42.67 5.27,45.25 LED103.A
N$60  (via drill 0.4)
  Top 0.203: R42.2 10.9,29.62 12.44,28.07 IC8.13 14.14,28.07 14.42,27.8 15.83,27.8 16.02,27.98 v16.52,27.98 | v13.01,10.22 11.96,9.17 R55.1
  Bottom 0.203: v16.52,27.98 16.52,23.23 17.33,22.42 17.33,11.65 16.06,10.38 13.17,10.38 v13.01,10.22
N$61
  Top 0.203: J105.P2 7.44,9.19 R55.2
N$62
  Top 0.203: R41.1 7.49,28.8 IC8.1 9.11,28.72 10.03,27.8 10.03,25.14 8.4,23.5 R45.2
N$63
  Top 0.203: R7.1 1.88,73.3 C13.1
N$67  (via drill 0.4)
  Top 0.203: v0.97,23.92 0.62,24.27 0.62,55.59 3.02,57.99 3.38,57.99 4.4,59 C19.1 4.4,59.32 3.29,60.42 3.29,62.19 3.11,62.37 2.69,62.37 IC5.6 2.31,62.37 1.87,62.37 1.66,62.17 v0.97,62.17 | R52.1 6.85,19.9 | v1.45,21.1 2.39,20.17 6.4,20.17 R52.1 | R52.1 7.02,20.26 | R49.1 7.96,21.2 R52.1 | v2.27,83.04 2.69,83.46 IC3.4
  Bottom 0.203: v2.27,83.04 2.27,80.98 0.62,79.33 0.62,62.52 v0.97,62.17 | v1.45,21.1 0.97,21.58 v0.97,23.92
N$68  (via drill 0.4)
  Top 0.203: v1.4,61.1 2.21,61.91 IC5.7 2.88,61.52 2.88,60.07 3.1,59.85 C19.2 | IC3.14 IC3.3 7.37,84.74 v3.02,84.74
  Bottom 0.203: v3.02,84.74 v3.03,84.73 3.03,80.54 1.06,78.57 1.06,63.15 1.79,62.42 1.79,61.66 1.4,61.27 v1.4,61.1
N$70  (via drill 0.4)
  Top 0.203: v1.4,27.98 1.4,27.38 R43.1
  Bottom 0.203: POT101.2 5.14,50.37 5.22,50.29 5.22,49.19 0.67,44.64 0.67,28.71 v1.4,27.98
N$87
  Top 0.203: J102.P2 12.8,14.27 R54.2
N$93
  Top 0.203: R49.2 6.23,21.7 5.15,21.7 J103.P3
N$94
  Top 0.203: R53.2 5.05,14.18 J103.P2
N$97
  Top 0.203: R39.1 11.33,34.12 R37.1 11.51,34.32 11.51,35.91 12.18,36.59 12.62,36.59 IC7.10
N$98
  Top 0.203: R51.1 11.33,20.12 R50.1 13.91,20.88 13.91,25.87 13.61,26.18 IC8.10
N$102  (via drill 0.4)
  Top 0.203: IC5.10 7.48,63.18 7.13,63.54 7.13,63.98 v6.68,64.42 | R15.1 6.88,58.83 R18.1 5.63,57.24 v6.83,56.04
  Bottom 0.203: v6.68,64.42 6.43,64.17 6.43,56.45 v6.83,56.04
N$103
  Top 0.203: IC6.10 17.65,63.16 17.47,62.98 17.24,62.98 16.65,62.39 16.65,61.44 16.83,61.26 R16.1 16.83,59.72 16.08,58.97 16.08,56.77 R20.1
OUT
  Top 0.203: IC8.14 12.67,28.71 12.2,29.18 R42.1 12.13,30.12 11.35,30.9 6.71,30.9 6.32,31.29 6.32,33.02 5.31,34.03 2.23,34.03 1.29,34.96 1.29,37.06 2.26,38.02 J1.1
OUT2  (via drill 0.4)
  Top 0.203: R37.2 R36.1 | R36.1 8.46,33.94 8.27,33.94 C25.2 | R36.1 7.37,35.03 IC7.7 9.46,35.49 v10.19,36.23 | v11.08,17.48 11.08,15.54 v10.83,15.29 | v11.02,3.1 11.83,2.29 R57.2
  Bottom 0.203: v11.08,17.48 11.08,17.9 11.36,18.19 11.36,24.2 10.76,24.8 10.76,35.66 v10.19,36.23 | v11.02,3.1 10.83,3.29 v10.83,15.29
OUT3
  Top 0.203: IC8.7 6.76,24.9 5.71,23.85 3.35,23.85 2.97,23.47 R46.1 0.69,21.91 0.69,18.04 | 0.69,18.04 0.69,2.55 R58.2 | C28.2 9.91,19.99 R51.2 10.07,19.8 10.07,18.75 6.97,15.65 3.08,15.65 0.69,18.04
VCC  (via drill 0.4)
  Top 0.356: 11.6,63.79 10.95,63.14
  Top 0.406: C1.1 16.31,101.38 L2.1 17.65,99.38 C4.+ 17.4,95.89 | 17.4,95.89 16.5,95.89 15.79,95.18 R3.1 | 17.4,95.89 17.4,94.82 15.91,93.33 15.91,90.67 15.47,90.23 C7.1 | 10.95,63.14 C18.1 | 11.6,63.79 IC6.4 12.5,63.87 13.58,63.87 v13.58,65.35 | C16.1 1.46,63.82 IC5.4 4.11,63.82 v4.71,64.42 | v8.83,26.85 8.78,26.8 IC8.4 5.63,26.8 C26.1 | v8.65,43.17 8.33,42.85 C23.1 8.33,40.13 8.67,39.79 8.67,37.93 8.15,37.41 7.38,37.41 IC7.4 | v16.58,85.79 15.47,86.9 C7.1 | C7.1 15.45,87.27 IC3.16 11.87,87.97 6.04,87.97 5.78,88.23 4.11,88.23 3.33,87.45 R5.1
  Bottom 0.406: v8.83,26.85 8.46,27.23 8.46,42.98 v8.65,43.17 8.58,43.23 8.58,43.42 8.98,43.82 8.98,52.64 5.91,55.71 5.91,63.21 v4.71,64.42 4.77,64.35 5.33,64.35 7.52,66.54 12.4,66.54 v13.58,65.35 14.58,66.35 14.58,73.01 16.48,74.91 16.48,85.69 v16.58,85.79
VEE  (via drill 0.4)
  Top 0.406: R1.1 9.14,101.15 D2.A 5.54,98.98 4.59,98.98 4.02,98.41 2.98,98.41 2.42,98.98 2.21,98.98 | L1.1 2.1,99.37 C3.1 2.21,98.98 | 2.21,98.98 C6.- 4.04,93.75 4.04,92.63 4.93,91.73 13.58,91.73 14.33,90.98 v14.33,88.42 | C27.2 14.63,26.8 IC8.11 11.63,26.8 v11.58,26.85 | C24.2 14.73,37.93 14.28,37.47 12.88,37.47 IC7.11 12.72,37.47 11.64,37.47 v11.52,37.35 | IC5.11 8.9,63.82 C17.2 9.65,63.42 v9.71,63.35 | v16.46,63.3 16.94,63.79 IC6.11 17.94,63.87 18.52,63.87 18.76,64.11 18.76,66.02 18.7,66.08 C14.2 18.26,67.47 18.26,71.37 18.94,72.06 18.94,74.62 15.17,78.39 | v12.89,77.36 12.89,78.25 12.78,78.36 | IC3.9 12.59,78.36 12.78,78.36 | C10.2 15.17,78.39 | 15.17,78.39 15.14,78.36 12.78,78.36
  Bottom 0.406: v11.58,26.85 11.52,26.92 v11.52,37.35 11.21,37.67 11.21,41.2 10.97,41.43 10.97,49.3 11.11,49.43 11.11,50.15 10.7,50.56 10.7,55.86 12.9,58.05 12.9,61.07 12.38,61.59 11.47,61.59 v9.71,63.35 13.55,63.35 13.6,63.4 16.36,63.4 v16.46,63.3 | v14.33,88.42 15.08,87.67 15.08,79.55 v12.89,77.36

### Text on the board
tPlace: Out | In | In | OUT | GND | GND | 2B v1.03 copyright forestcaver 2020